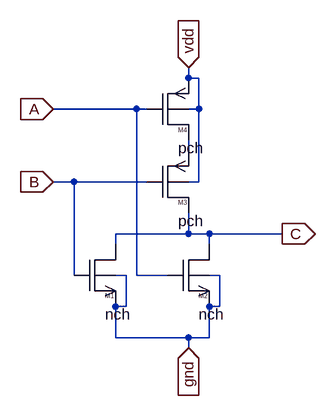
[diagram p0: schematic mynor2.asc]
mynor2.asc, the LTspice schematic file:
Version 4
SHEET 1 880 680
WIRE 240 -32 240 -48
WIRE 256 -32 240 -32
WIRE 160 16 32 16
WIRE 176 16 160 16
WIRE 256 16 256 -32
WIRE 256 16 240 16
WIRE 240 80 240 64
WIRE 64 128 32 128
WIRE 176 128 64 128
WIRE 256 128 256 16
WIRE 256 128 240 128
WIRE 240 208 240 176
WIRE 240 208 128 208
WIRE 272 208 240 208
WIRE 384 208 272 208
WIRE 128 224 128 208
WIRE 272 224 272 208
WIRE 64 272 64 128
WIRE 144 272 128 272
WIRE 160 272 160 16
WIRE 208 272 160 272
WIRE 288 272 272 272
WIRE 144 320 144 272
WIRE 144 320 128 320
WIRE 288 320 288 272
WIRE 288 320 272 320
WIRE 128 368 128 320
WIRE 240 368 128 368
WIRE 272 368 272 320
WIRE 272 368 240 368
WIRE 240 384 240 368
FLAG 32 16 A
IOPIN 32 16 In
FLAG 32 128 B
IOPIN 32 128 In
FLAG 384 208 C
IOPIN 384 208 Out
FLAG 240 -48 vdd
IOPIN 240 -48 In
FLAG 240 384 gnd
IOPIN 240 384 In
SYMBOL nmos4 64 272 R0
WINDOW 3 48 60 Left 2
SYMATTR InstName M1
SYMATTR Value nch
SYMATTR Value2 l=2u w=6u
SYMBOL nmos4 208 272 R0
WINDOW 3 48 60 Left 2
SYMATTR InstName M2
SYMATTR Value nch
SYMATTR Value2 l=2u w=6u
SYMBOL pmos4 176 128 R0
WINDOW 3 48 60 Left 2
SYMATTR InstName M3
SYMATTR Value pch
SYMATTR Value2 l=2u w=18u
SYMBOL pmos4 176 16 R0
WINDOW 3 48 60 Left 2
SYMATTR InstName M4
SYMATTR Value pch
SYMATTR Value2 l=2u w=18u

The netlist it stands for:
* mynor2.asc
M1 C B gnd gnd nch l=2u w=6u
M2 C A gnd gnd nch l=2u w=6u
M3 C B N001 vdd pch l=2u w=18u
M4 N001 A vdd vdd pch l=2u w=18u
.model NMOS NMOS
.model PMOS PMOS
.lib standard.mos
.backanno
.end